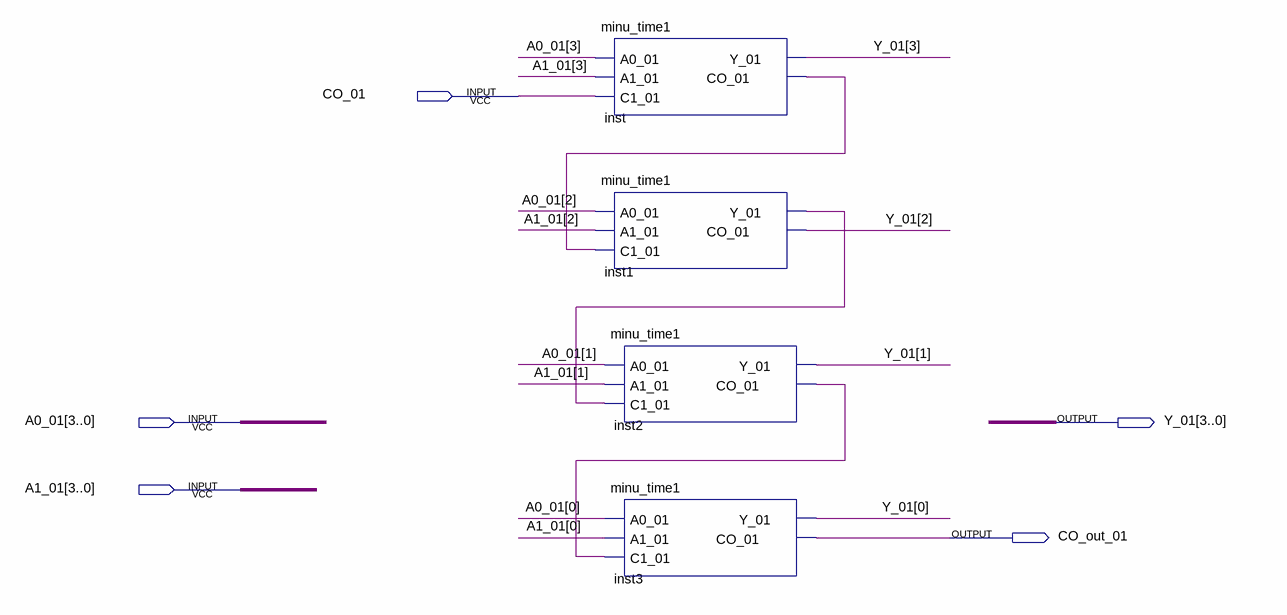
[diagram p0: schematic sheet]
// Quartus schematic minu_time4.bdf as structural Verilog: 4 symbols, 5 pins
module minu_time4 (
  input  CO_01,
  input  [3:0] A0_01,
  input  [3:0] A1_01,
  output [3:0] Y_01,
  output CO_out_01
);

  wire inst1_y_01, inst2_co_01, inst_co_01;

  minu_time1 inst (.A0_01(A0_01[3]), .A1_01(A1_01[3]), .C1_01(CO_01), .Y_01(Y_01[3]), .CO_01(inst_co_01));
  minu_time1 inst1 (.A0_01(A0_01[2]), .A1_01(A1_01[2]), .C1_01(inst_co_01), .Y_01(inst1_y_01), .CO_01(Y_01[2]));
  minu_time1 inst2 (.A0_01(A0_01[1]), .A1_01(A1_01[1]), .C1_01(inst1_y_01), .Y_01(Y_01[1]), .CO_01(inst2_co_01));
  minu_time1 inst3 (.A0_01(A0_01[0]), .A1_01(A1_01[0]), .C1_01(inst2_co_01), .Y_01(Y_01[0]), .CO_01(CO_out_01));
endmodule
